# Altium project CMUT_Receiver.PrjPcb
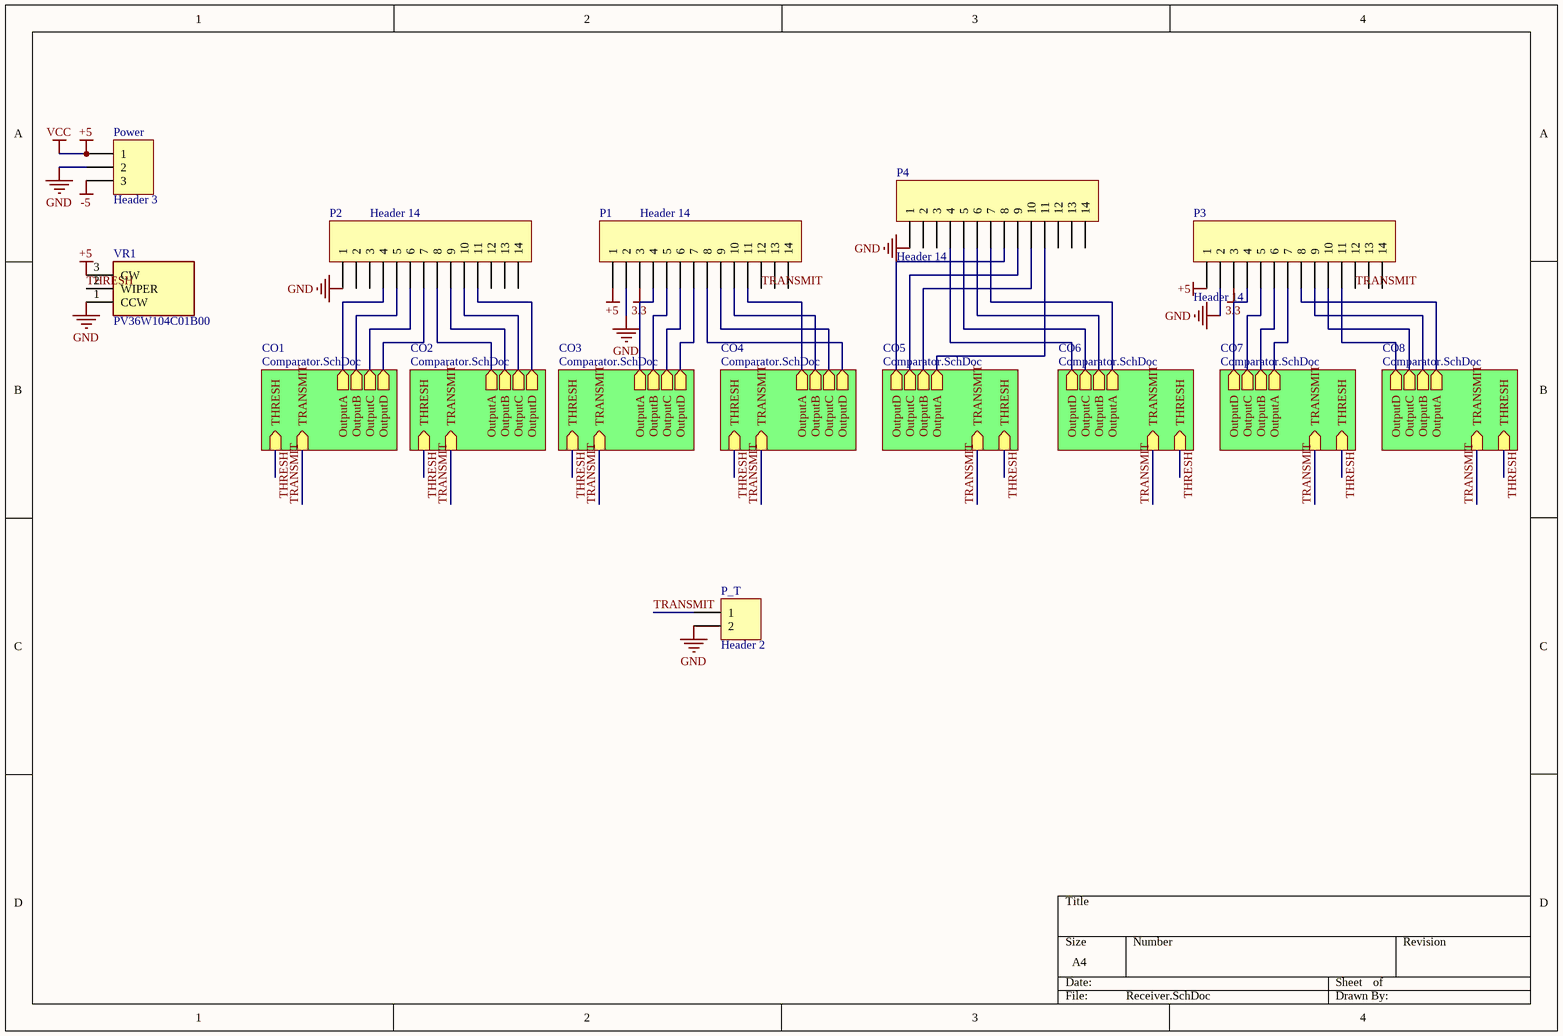
[diagram p0: Receiver.SchDoc]
2 sheets, 303 parts. Net scope: hierarchical (ports join the sheet entries above them; power ports are global).
Board file: Receiver.PcbDoc
Sheets:
  Receiver.SchDoc
    CO1 = Comparator.SchDoc
    CO2 = Comparator.SchDoc
    CO3 = Comparator.SchDoc
    CO4 = Comparator.SchDoc
    CO5 = Comparator.SchDoc
    CO6 = Comparator.SchDoc
    CO7 = Comparator.SchDoc
    CO8 = Comparator.SchDoc

## Sheet Receiver.SchDoc
size A4

### Parts
P1  Header 14  [HDR1X14]
P2  Header 14  [HDR1X14]
P3  Header 14  [HDR1X14]
P4  Header 14  [HDR1X14]
P_T  Header 2  [HDR1X2]
Power  Header 3  [HDR1X3]
VR1  PV36W104C01B00  [PV36W]

### Sub-sheets
CO1 = Comparator.SchDoc: THRESH (in), OutputD (out), OutputC (out), OutputB (out), OutputA (out), TRANSMIT (in)
CO2 = Comparator.SchDoc: THRESH (in), OutputD (out), OutputC (out), OutputB (out), OutputA (out), TRANSMIT (in)
CO3 = Comparator.SchDoc: THRESH (in), OutputD (out), OutputC (out), OutputB (out), OutputA (out), TRANSMIT (in)
CO4 = Comparator.SchDoc: THRESH (in), OutputD (out), OutputC (out), OutputB (out), OutputA (out), TRANSMIT (in)
CO5 = Comparator.SchDoc: THRESH (in), OutputD (out), OutputC (out), OutputB (out), OutputA (out), TRANSMIT (in)
CO6 = Comparator.SchDoc: THRESH (in), OutputD (out), OutputC (out), OutputB (out), OutputA (out), TRANSMIT (in)
CO7 = Comparator.SchDoc: THRESH (in), OutputD (out), OutputC (out), OutputB (out), OutputA (out), TRANSMIT (in)
CO8 = Comparator.SchDoc: THRESH (in), OutputD (out), OutputC (out), OutputB (out), OutputA (out), TRANSMIT (in)

### Nets
3.3: P1.3 P3.3
+5: P1.1 P3.1 Power.1 VR1.3(CW)  [also labelled VCC]
-5: Power.3
GND: P1.2 P2.1 P3.2 P4.1 P_T.2 Power.2 VR1.1(CCW)
THRESH: VR1.2(WIPER) ; sheet CO1/THRESH, sheet CO2/THRESH, sheet CO3/THRESH, sheet CO4/THRESH, sheet CO5/THRESH, sheet CO6/THRESH, sheet CO7/THRESH, sheet CO8/THRESH
TRANSMIT: P1.12 P3.12 P_T.1 ; sheet CO1/TRANSMIT, sheet CO2/TRANSMIT, sheet CO3/TRANSMIT, sheet CO4/TRANSMIT, sheet CO5/TRANSMIT, sheet CO6/TRANSMIT, sheet CO7/TRANSMIT, sheet CO8/TRANSMIT
NetIC4_CO1_2: P2.4 ; sheet CO1/OutputA
NetIC4_CO1_3: P2.5 ; sheet CO1/OutputB
NetIC4_CO1_4: P2.6 ; sheet CO1/OutputC
NetIC4_CO1_5: P2.7 ; sheet CO1/OutputD
NetIC4_CO2_2: P2.8 ; sheet CO2/OutputA
NetIC4_CO2_3: P2.9 ; sheet CO2/OutputB
NetIC4_CO2_4: P2.10 ; sheet CO2/OutputC
NetIC4_CO2_5: P2.11 ; sheet CO2/OutputD
NetIC4_CO3_2: P1.4 ; sheet CO3/OutputA
NetIC4_CO3_3: P1.5 ; sheet CO3/OutputB
NetIC4_CO3_4: P1.6 ; sheet CO3/OutputC
NetIC4_CO3_5: P1.7 ; sheet CO3/OutputD
NetIC4_CO4_2: P1.11 ; sheet CO4/OutputA
NetIC4_CO4_3: P1.10 ; sheet CO4/OutputB
NetIC4_CO4_4: P1.9 ; sheet CO4/OutputC
NetIC4_CO4_5: P1.8 ; sheet CO4/OutputD
NetIC4_CO5_2: P4.11 ; sheet CO5/OutputA
NetIC4_CO5_3: P4.10 ; sheet CO5/OutputB
NetIC4_CO5_4: P4.9 ; sheet CO5/OutputC
NetIC4_CO5_5: P4.8 ; sheet CO5/OutputD
NetIC4_CO6_2: P4.7 ; sheet CO6/OutputA
NetIC4_CO6_3: P4.6 ; sheet CO6/OutputB
NetIC4_CO6_4: P4.5 ; sheet CO6/OutputC
NetIC4_CO6_5: P4.4 ; sheet CO6/OutputD
NetIC4_CO7_2: P3.7 ; sheet CO7/OutputA
NetIC4_CO7_3: P3.6 ; sheet CO7/OutputB
NetIC4_CO7_4: P3.5 ; sheet CO7/OutputC
NetIC4_CO7_5: P3.4 ; sheet CO7/OutputD
NetIC4_CO8_2: P3.8 ; sheet CO8/OutputA
NetIC4_CO8_3: P3.9 ; sheet CO8/OutputB
NetIC4_CO8_4: P3.10 ; sheet CO8/OutputC
NetIC4_CO8_5: P3.11 ; sheet CO8/OutputD

Not connected (* = marked no-connect by the designer): P1 13 14; P2 2 3 12 13 14; P3 13 14; P4 2 3 12 13 14

### Library data of the parts
P1-P4 = Header 14: Header, 14-Pin; LatestRevisionDate: 17-Jul-2002; LatestRevisionNote: Re-released for DXP Platform.; Publisher: Altium Limited
P_T = Header 2: Header, 2-Pin; LatestRevisionDate: 17-Jul-2002; LatestRevisionNote: Re-released for DXP Platform.; Publisher: Altium Limited
Power = Header 3: Header, 3-Pin; LatestRevisionDate: 17-Jul-2002; LatestRevisionNote: Re-released for DXP Platform.; Publisher: Altium Limited
VR1 = PV36W104C01B00: Variable Resistor; Manufacturer_Name: Bourns; Allied_Number: 71024705; Datasheet Link: https://www.bourns.com/docs/Product-Datasheets/pv36.pdf; Manufacturer_Part_Number: PV36W104C01B00; Mouser Part Number: 81-PV36W104C01B00; Mouser Price/Stock: https://www.mouser.com/Search/Refine.aspx?Keyword=81-PV36W104C01B00; RS Part Number: 7692160P; RS Price/Stock: http://uk.rs-online.com/web/p/products/7692160P; Allied Price/Stock: https://www.alliedelec.com/bourns-pv36w104c01b00/71024705/

## Sheet Comparator.SchDoc
size A4
Used 8 times, as channels CO1, CO2, CO3, CO4, CO5, CO6, CO7, CO8. Parts and nets are listed once, with the designators drawn on the sheet.
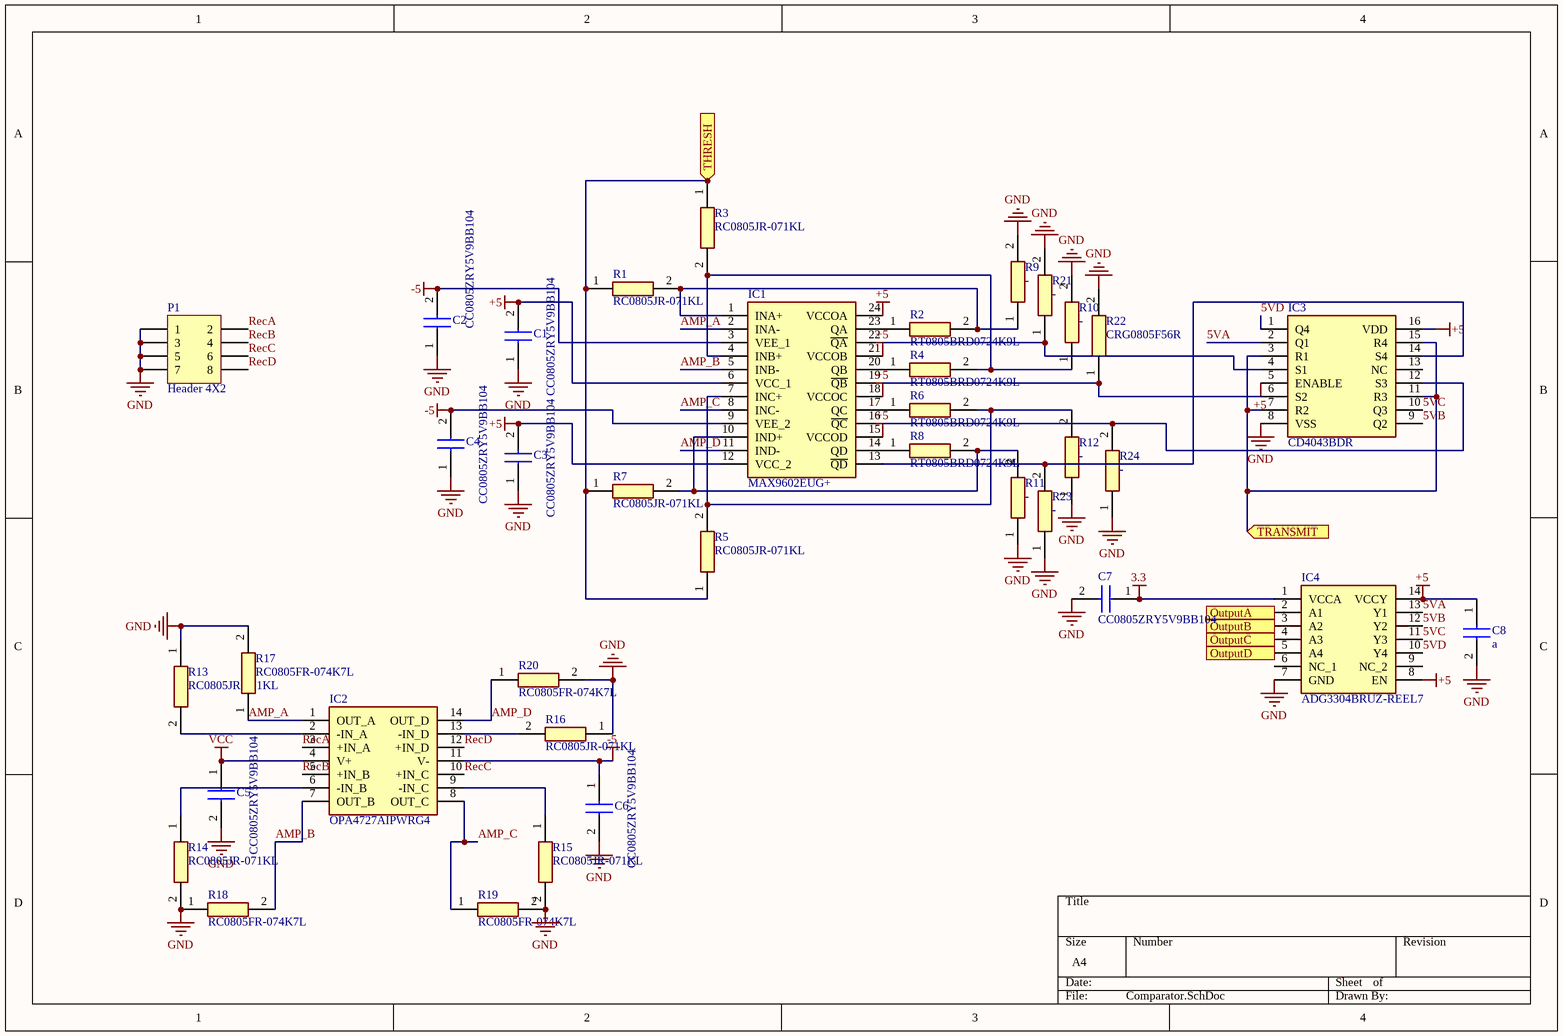
[diagram p1: Comparator.SchDoc]

### Parts
C1  CC0805ZRY5V9BB104  [CAPC2013X70N]
C2  CC0805ZRY5V9BB104  [CAPC2013X70N]
C3  CC0805ZRY5V9BB104  [CAPC2013X70N]
C4  CC0805ZRY5V9BB104  [CAPC2013X70N]
C5  CC0805ZRY5V9BB104  [CAPC2013X70N]
C6  CC0805ZRY5V9BB104  [CAPC2013X70N]
C7  CC0805ZRY5V9BB104  [CAPC2013X70N]
C8  a  [CAPC2013X70N]
IC1  MAX9602EUG+  [SOP65P640X110-24N]
IC2  OPA4727AIPWRG4  [SOP65P640X120-14N]
IC3  CD4043BDR  [SOIC127P600X175-16N]
IC4  ADG3304BRUZ-REEL7  [SOP65P640X120-14N]
P1  Header 4X2  [HDR2X4]
R1  RC0805JR-071KL  [RESC2012X60N]
R2  RT0805BRD0724K9L  [RESC2012X60N]
R3  RC0805JR-071KL  [RESC2012X60N]
R4  RT0805BRD0724K9L  [RESC2012X60N]
R5  RC0805JR-071KL  [RESC2012X60N]
R6  RT0805BRD0724K9L  [RESC2012X60N]
R7  RC0805JR-071KL  [RESC2012X60N]
R8  RT0805BRD0724K9L  [RESC2012X60N]
R9  -  [RESC2012X65N]
R10  -  [RESC2012X65N]
R11  -  [RESC2012X65N]
R12  -  [RESC2012X65N]
R13  RC0805JR-071KL  [RESC2012X60N]
R14  RC0805JR-071KL  [RESC2012X60N]
R15  RC0805JR-071KL  [RESC2012X60N]
R16  RC0805JR-071KL  [RESC2012X60N]
R17  RC0805FR-074K7L  [RESC2012X60N]
R18  RC0805FR-074K7L  [RESC2012X60N]
R19  RC0805FR-074K7L  [RESC2012X60N]
R20  RC0805FR-074K7L  [RESC2012X60N]
R21  -  [RESC2012X65N]
R22  CRG0805F56R  [RESC2012X65N]
R23  -  [RESC2012X65N]
R24  -  [RESC2012X65N]

### Ports
OutputA (out), OutputB (out), OutputC (out), OutputD (out), THRESH (in), TRANSMIT (in)

### Nets
3.3: C7.1(C1) IC4.1(VCCA)
+5: C1.2(C2) C3.2(C2) C8.1(C1) IC1.6(VCC_1) IC1.12(VCC_2) IC1.15(VCCOD) IC1.18(VCCOC) IC1.21(VCCOB) IC1.24(VCCOA) IC3.5(ENABLE) IC3.16(VDD) IC4.8(EN) IC4.14(VCCY)
-5: C2.2(C2) C4.2(C2) C6.1(C1) IC1.3(VEE_1) IC1.9(VEE_2) IC2.11(V-)
GND: C1.1(C1) C2.1(C1) C3.1(C1) C4.1(C1) C5.2(C2) C6.2(C2) C7.2(C2) C8.2(C2) IC3.8(VSS) IC4.7(GND) P1.1 P1.3 P1.5 P1.7 R9.2 R10.2 R11.1 R12.1 R13.1 R14.2 R15.2 R16.1 R17.2 R18.1 R19.2 R20.2 R21.2 R22.2 R23.1 R24.1
VCC: C5.1(C1) IC2.4(V+)
5VA: IC3.2(Q1) IC4.13(Y1)
5VB: IC3.9(Q2) IC4.12(Y2)
5VC: IC3.10(Q3) IC4.11(Y3)
5VD: IC3.1(Q4) IC4.10(Y4)
AMP_A: IC1.2(INA-) IC2.1(OUT_A) R17.1
AMP_B: IC1.5(INB-) IC2.7(OUT_B) R18.2
AMP_C: IC1.8(INC-) IC2.8(OUT_C) R19.1
AMP_D: IC1.11(IND-) IC2.14(OUT_D) R20.1
OutputA: IC4.2(A1) ; port OutputA
OutputB: IC4.3(A2) ; port OutputB
OutputC: IC4.4(A3) ; port OutputC
OutputD: IC4.5(A4) ; port OutputD
RecA: IC2.3(+IN_A) P1.2
RecB: IC2.5(+IN_B) P1.4
RecC: IC2.10(+IN_C) P1.6
RecD: IC2.12(+IN_D) P1.8
THRESH: R1.1 R3.1 R5.1 R7.1 ; port THRESH
TRANSMIT: IC3.3(R1) IC3.7(R2) IC3.11(R3) IC3.15(R4) ; port TRANSMIT
NetIC1_1: IC1.1(INA+) R1.2 R2.2 R9.1
NetIC1_4: IC1.4(INB+) R3.2 R4.2 R10.1
NetIC1_7: IC1.7(INC+) R5.2 R6.2 R12.2
NetIC1_10: IC1.10(IND+) R7.2 R8.2 R11.2
NetIC1_13: IC1.13(~{QD}) IC3.14(S4) R23.2
NetIC1_14: IC1.14(QD) R8.1
NetIC1_16: IC1.16(~{QC}) IC3.12(S3) R24.2
NetIC1_17: IC1.17(QC) R6.1
NetIC1_19: IC1.19(~{QB}) IC3.6(S2) R22.1
NetIC1_20: IC1.20(QB) R4.1
NetIC1_22: IC1.22(~{QA}) IC3.4(S1) R21.1
NetIC1_23: IC1.23(QA) R2.1
NetIC2_2: IC2.2(-IN_A) R13.2
NetIC2_6: IC2.6(-IN_B) R14.1
NetIC2_9: IC2.9(-IN_C) R15.1
NetIC2_13: IC2.13(-IN_D) R16.2

Not connected (* = marked no-connect by the designer): IC3 13(NC); IC4 6(NC_1) 9(NC_2)

### Channels
CO1: designators end in _CO1; ports OutputA=NetIC4_CO1_2 OutputB=NetIC4_CO1_3 OutputC=NetIC4_CO1_4 OutputD=NetIC4_CO1_5 THRESH=THRESH TRANSMIT=TRANSMIT
CO2: designators end in _CO2; ports OutputA=NetIC4_CO2_2 OutputB=NetIC4_CO2_3 OutputC=NetIC4_CO2_4 OutputD=NetIC4_CO2_5 THRESH=THRESH TRANSMIT=TRANSMIT
CO3: designators end in _CO3; ports OutputA=NetIC4_CO3_2 OutputB=NetIC4_CO3_3 OutputC=NetIC4_CO3_4 OutputD=NetIC4_CO3_5 THRESH=THRESH TRANSMIT=TRANSMIT
CO4: designators end in _CO4; ports OutputA=NetIC4_CO4_2 OutputB=NetIC4_CO4_3 OutputC=NetIC4_CO4_4 OutputD=NetIC4_CO4_5 THRESH=THRESH TRANSMIT=TRANSMIT
CO5: designators end in _CO5; ports OutputA=NetIC4_CO5_2 OutputB=NetIC4_CO5_3 OutputC=NetIC4_CO5_4 OutputD=NetIC4_CO5_5 THRESH=THRESH TRANSMIT=TRANSMIT
CO6: designators end in _CO6; ports OutputA=NetIC4_CO6_2 OutputB=NetIC4_CO6_3 OutputC=NetIC4_CO6_4 OutputD=NetIC4_CO6_5 THRESH=THRESH TRANSMIT=TRANSMIT
CO7: designators end in _CO7; ports OutputA=NetIC4_CO7_2 OutputB=NetIC4_CO7_3 OutputC=NetIC4_CO7_4 OutputD=NetIC4_CO7_5 THRESH=THRESH TRANSMIT=TRANSMIT
CO8: designators end in _CO8; ports OutputA=NetIC4_CO8_2 OutputB=NetIC4_CO8_3 OutputC=NetIC4_CO8_4 OutputD=NetIC4_CO8_5 THRESH=THRESH TRANSMIT=TRANSMIT

### Library data of the parts
C1-C8 = CC0805ZRY5V9BB104: Capacitor; Manufacturer_Name: YAGEO (PHYCOMP); Datasheet Link: http://componentsearchengine.com/Datasheets/1/CC0805ZRY5V9BB104.pdf; Manufacturer_Part_Number: CC0805ZRY5V9BB104; Mouser Part Number: 603-CC805ZRY5V9BB104; Mouser Price/Stock: https://www.mouser.com/Search/Refine.aspx?Keyword=603-CC805ZRY5V9BB104
IC1 = MAX9602EUG+: Integrated Circuit; Manufacturer_Name: Maxim Integrated; Datasheet Link: https://componentsearchengine.com/Datasheets/1/MAX9602EUG+.pdf; Height: 1.1mm; Manufacturer_Part_Number: MAX9602EUG+; Mouser Part Number: 700-MAX9602EUG; Mouser Price/Stock: https://www.mouser.com/Search/Refine.aspx?Keyword=700-MAX9602EUG
IC2 = OPA4727AIPWRG4: Integrated Circuit; Manufacturer_Name: Texas Instruments; Datasheet Link: http://www.ti.com/lit/ds/symlink/opa727.pdf; Height: 1.2mm; Manufacturer_Part_Number: OPA4727AIPWRG4; Mouser Part Number: 595-OPA4727AIPWRG4; Mouser Price/Stock: https://www.mouser.com/Search/Refine.aspx?Keyword=595-OPA4727AIPWRG4
IC3 = CD4043BDR: Integrated Circuit; Manufacturer_Name: Texas Instruments; Datasheet Link: http://www.ti.com/lit/ds/symlink/cd4043b.pdf; Height: 1.75mm; Manufacturer_Part_Number: CD4043BDR; Mouser Part Number: 595-CD4043BDR; Mouser Price/Stock: https://www.mouser.com/Search/Refine.aspx?Keyword=595-CD4043BDR
IC4 = ADG3304BRUZ-REEL7: Integrated Circuit; Manufacturer_Name: Analog Devices; Datasheet Link: http://componentsearchengine.com/Datasheets/1/ADG3304BRUZ-REEL7.pdf; Height: 1.2mm; Manufacturer_Part_Number: ADG3304BRUZ-REEL7; Mouser Part Number: 584-ADG3304BRUZ-R7; Mouser Price/Stock: https://www.mouser.com/Search/Refine.aspx?Keyword=584-ADG3304BRUZ-R7
P1 = Header 4X2: Header, 4-Pin, Dual row; LatestRevisionDate: 17-Jul-2002; LatestRevisionNote: Re-released for DXP Platform.; Publisher: Altium Limited
R1 R3 R5 R7 R13-R16 = RC0805JR-071KL: Resistor; Manufacturer_Name: YAGEO (PHYCOMP); Datasheet Link: http://www.yageo.com/documents/recent/PYu-RC_Group_51_RoHS_L_10.pdf; Height: 0.6mm; Manufacturer_Part_Number: RC0805JR-071KL; Mouser Part Number: 603-RC0805JR-071KL; Mouser Price/Stock: https://www.mouser.com/Search/Refine.aspx?Keyword=603-RC0805JR-071KL
R2 R4 R6 R8 = RT0805BRD0724K9L: Resistor; Manufacturer_Name: YAGEO (PHYCOMP); Datasheet Link: http://www.yageo.com/documents/recent/PYu-RT_1-to-0.01_RoHS_L_9.pdf; Height: 0.6mm; Manufacturer_Part_Number: RT0805BRD0724K9L
R9-R12 R21-R24 = CRG0805F56R: Resistor; Manufacturer_Name: TE Connectivity; Allied_Number: 70063224; Datasheet Link: http://www.te.com/commerce/DocumentDelivery/DDEController?Action=showdoc&DocId=Customer+Drawing%7F1623109%7FBA%7Fpdf%7FEnglish%7FENG_CD_1623109_BA.pdf%7F1623109-1; Height: 0.65mm; Manufacturer_Part_Number: CRG0805F56R; RS Part Number: 2230269; RS Price/Stock: https://uk.rs-online.com/web/p/products/2230269; Allied Price/Stock: https://www.alliedelec.com/te-connectivity-crg0805f56r/70063224/
R17-R20 = RC0805FR-074K7L: Resistor; Manufacturer_Name: YAGEO (PHYCOMP); Datasheet Link: http://www.yageo.com/documents/recent/PYu-RC_Group_51_RoHS_L_10.pdf; Height: 0.6mm; Manufacturer_Part_Number: RC0805FR-074K7L; Mouser Part Number: 603-RC0805FR-074K7L; Mouser Price/Stock: https://www.mouser.com/Search/Refine.aspx?Keyword=603-RC0805FR-074K7L; RS Part Number: 6181408; RS Price/Stock: http://uk.rs-online.com/web/p/products/6181408

## Nets that join several sheets
3.3: Receiver (P1.3 P3.3), CO1 (C7_CO1.1 IC4_CO1.1), CO2 (C7_CO2.1 IC4_CO2.1), CO3 (C7_CO3.1 IC4_CO3.1), CO4 (C7_CO4.1 IC4_CO4.1), CO5 (C7_CO5.1 IC4_CO5.1), CO6 (C7_CO6.1 IC4_CO6.1), CO7 (C7_CO7.1 IC4_CO7.1), CO8 (C7_CO8.1 IC4_CO8.1)
+5: Receiver (P1.1 P3.1 Power.1 VR1.3), CO1 (15 pins), CO2 (15 pins), CO3 (15 pins), CO4 (15 pins), CO5 (15 pins), CO6 (15 pins), CO7 (15 pins), CO8 (15 pins)
-5: Receiver (Power.3), CO1 (6 pins), CO2 (6 pins), CO3 (6 pins), CO4 (6 pins), CO5 (6 pins), CO6 (6 pins), CO7 (6 pins), CO8 (6 pins)
GND: Receiver (7 pins), CO1 (30 pins), CO2 (30 pins), CO3 (30 pins), CO4 (30 pins), CO5 (30 pins), CO6 (30 pins), CO7 (30 pins), CO8 (30 pins)
NetIC4_CO1_2: Receiver (P2.4), CO1 (IC4_CO1.2)
NetIC4_CO1_3: Receiver (P2.5), CO1 (IC4_CO1.3)
NetIC4_CO1_4: Receiver (P2.6), CO1 (IC4_CO1.4)
NetIC4_CO1_5: Receiver (P2.7), CO1 (IC4_CO1.5)
NetIC4_CO2_2: Receiver (P2.8), CO2 (IC4_CO2.2)
NetIC4_CO2_3: Receiver (P2.9), CO2 (IC4_CO2.3)
NetIC4_CO2_4: Receiver (P2.10), CO2 (IC4_CO2.4)
NetIC4_CO2_5: Receiver (P2.11), CO2 (IC4_CO2.5)
NetIC4_CO3_2: Receiver (P1.4), CO3 (IC4_CO3.2)
NetIC4_CO3_3: Receiver (P1.5), CO3 (IC4_CO3.3)
NetIC4_CO3_4: Receiver (P1.6), CO3 (IC4_CO3.4)
NetIC4_CO3_5: Receiver (P1.7), CO3 (IC4_CO3.5)
NetIC4_CO4_2: Receiver (P1.11), CO4 (IC4_CO4.2)
NetIC4_CO4_3: Receiver (P1.10), CO4 (IC4_CO4.3)
NetIC4_CO4_4: Receiver (P1.9), CO4 (IC4_CO4.4)
NetIC4_CO4_5: Receiver (P1.8), CO4 (IC4_CO4.5)
NetIC4_CO5_2: Receiver (P4.11), CO5 (IC4_CO5.2)
NetIC4_CO5_3: Receiver (P4.10), CO5 (IC4_CO5.3)
NetIC4_CO5_4: Receiver (P4.9), CO5 (IC4_CO5.4)
NetIC4_CO5_5: Receiver (P4.8), CO5 (IC4_CO5.5)
NetIC4_CO6_2: Receiver (P4.7), CO6 (IC4_CO6.2)
NetIC4_CO6_3: Receiver (P4.6), CO6 (IC4_CO6.3)
NetIC4_CO6_4: Receiver (P4.5), CO6 (IC4_CO6.4)
NetIC4_CO6_5: Receiver (P4.4), CO6 (IC4_CO6.5)
NetIC4_CO7_2: Receiver (P3.7), CO7 (IC4_CO7.2)
NetIC4_CO7_3: Receiver (P3.6), CO7 (IC4_CO7.3)
NetIC4_CO7_4: Receiver (P3.5), CO7 (IC4_CO7.4)
NetIC4_CO7_5: Receiver (P3.4), CO7 (IC4_CO7.5)
NetIC4_CO8_2: Receiver (P3.8), CO8 (IC4_CO8.2)
NetIC4_CO8_3: Receiver (P3.9), CO8 (IC4_CO8.3)
NetIC4_CO8_4: Receiver (P3.10), CO8 (IC4_CO8.4)
NetIC4_CO8_5: Receiver (P3.11), CO8 (IC4_CO8.5)
THRESH: Receiver (VR1.2), CO1 (R1_CO1.1 R3_CO1.1 R5_CO1.1 R7_CO1.1), CO2 (R1_CO2.1 R3_CO2.1 R5_CO2.1 R7_CO2.1), CO3 (R1_CO3.1 R3_CO3.1 R5_CO3.1 R7_CO3.1), CO4 (R1_CO4.1 R3_CO4.1 R5_CO4.1 R7_CO4.1), CO5 (R1_CO5.1 R3_CO5.1 R5_CO5.1 R7_CO5.1), CO6 (R1_CO6.1 R3_CO6.1 R5_CO6.1 R7_CO6.1), CO7 (R1_CO7.1 R3_CO7.1 R5_CO7.1 R7_CO7.1), CO8 (R1_CO8.1 R3_CO8.1 R5_CO8.1 R7_CO8.1)
TRANSMIT: Receiver (P1.12 P3.12 P_T.1), CO1 (IC3_CO1.3 IC3_CO1.7 IC3_CO1.11 IC3_CO1.15), CO2 (IC3_CO2.3 IC3_CO2.7 IC3_CO2.11 IC3_CO2.15), CO3 (IC3_CO3.3 IC3_CO3.7 IC3_CO3.11 IC3_CO3.15), CO4 (IC3_CO4.3 IC3_CO4.7 IC3_CO4.11 IC3_CO4.15), CO5 (IC3_CO5.3 IC3_CO5.7 IC3_CO5.11 IC3_CO5.15), CO6 (IC3_CO6.3 IC3_CO6.7 IC3_CO6.11 IC3_CO6.15), CO7 (IC3_CO7.3 IC3_CO7.7 IC3_CO7.11 IC3_CO7.15), CO8 (IC3_CO8.3 IC3_CO8.7 IC3_CO8.11 IC3_CO8.15)